# EAGLE schematic decoder (EAGLE 9.6.2)
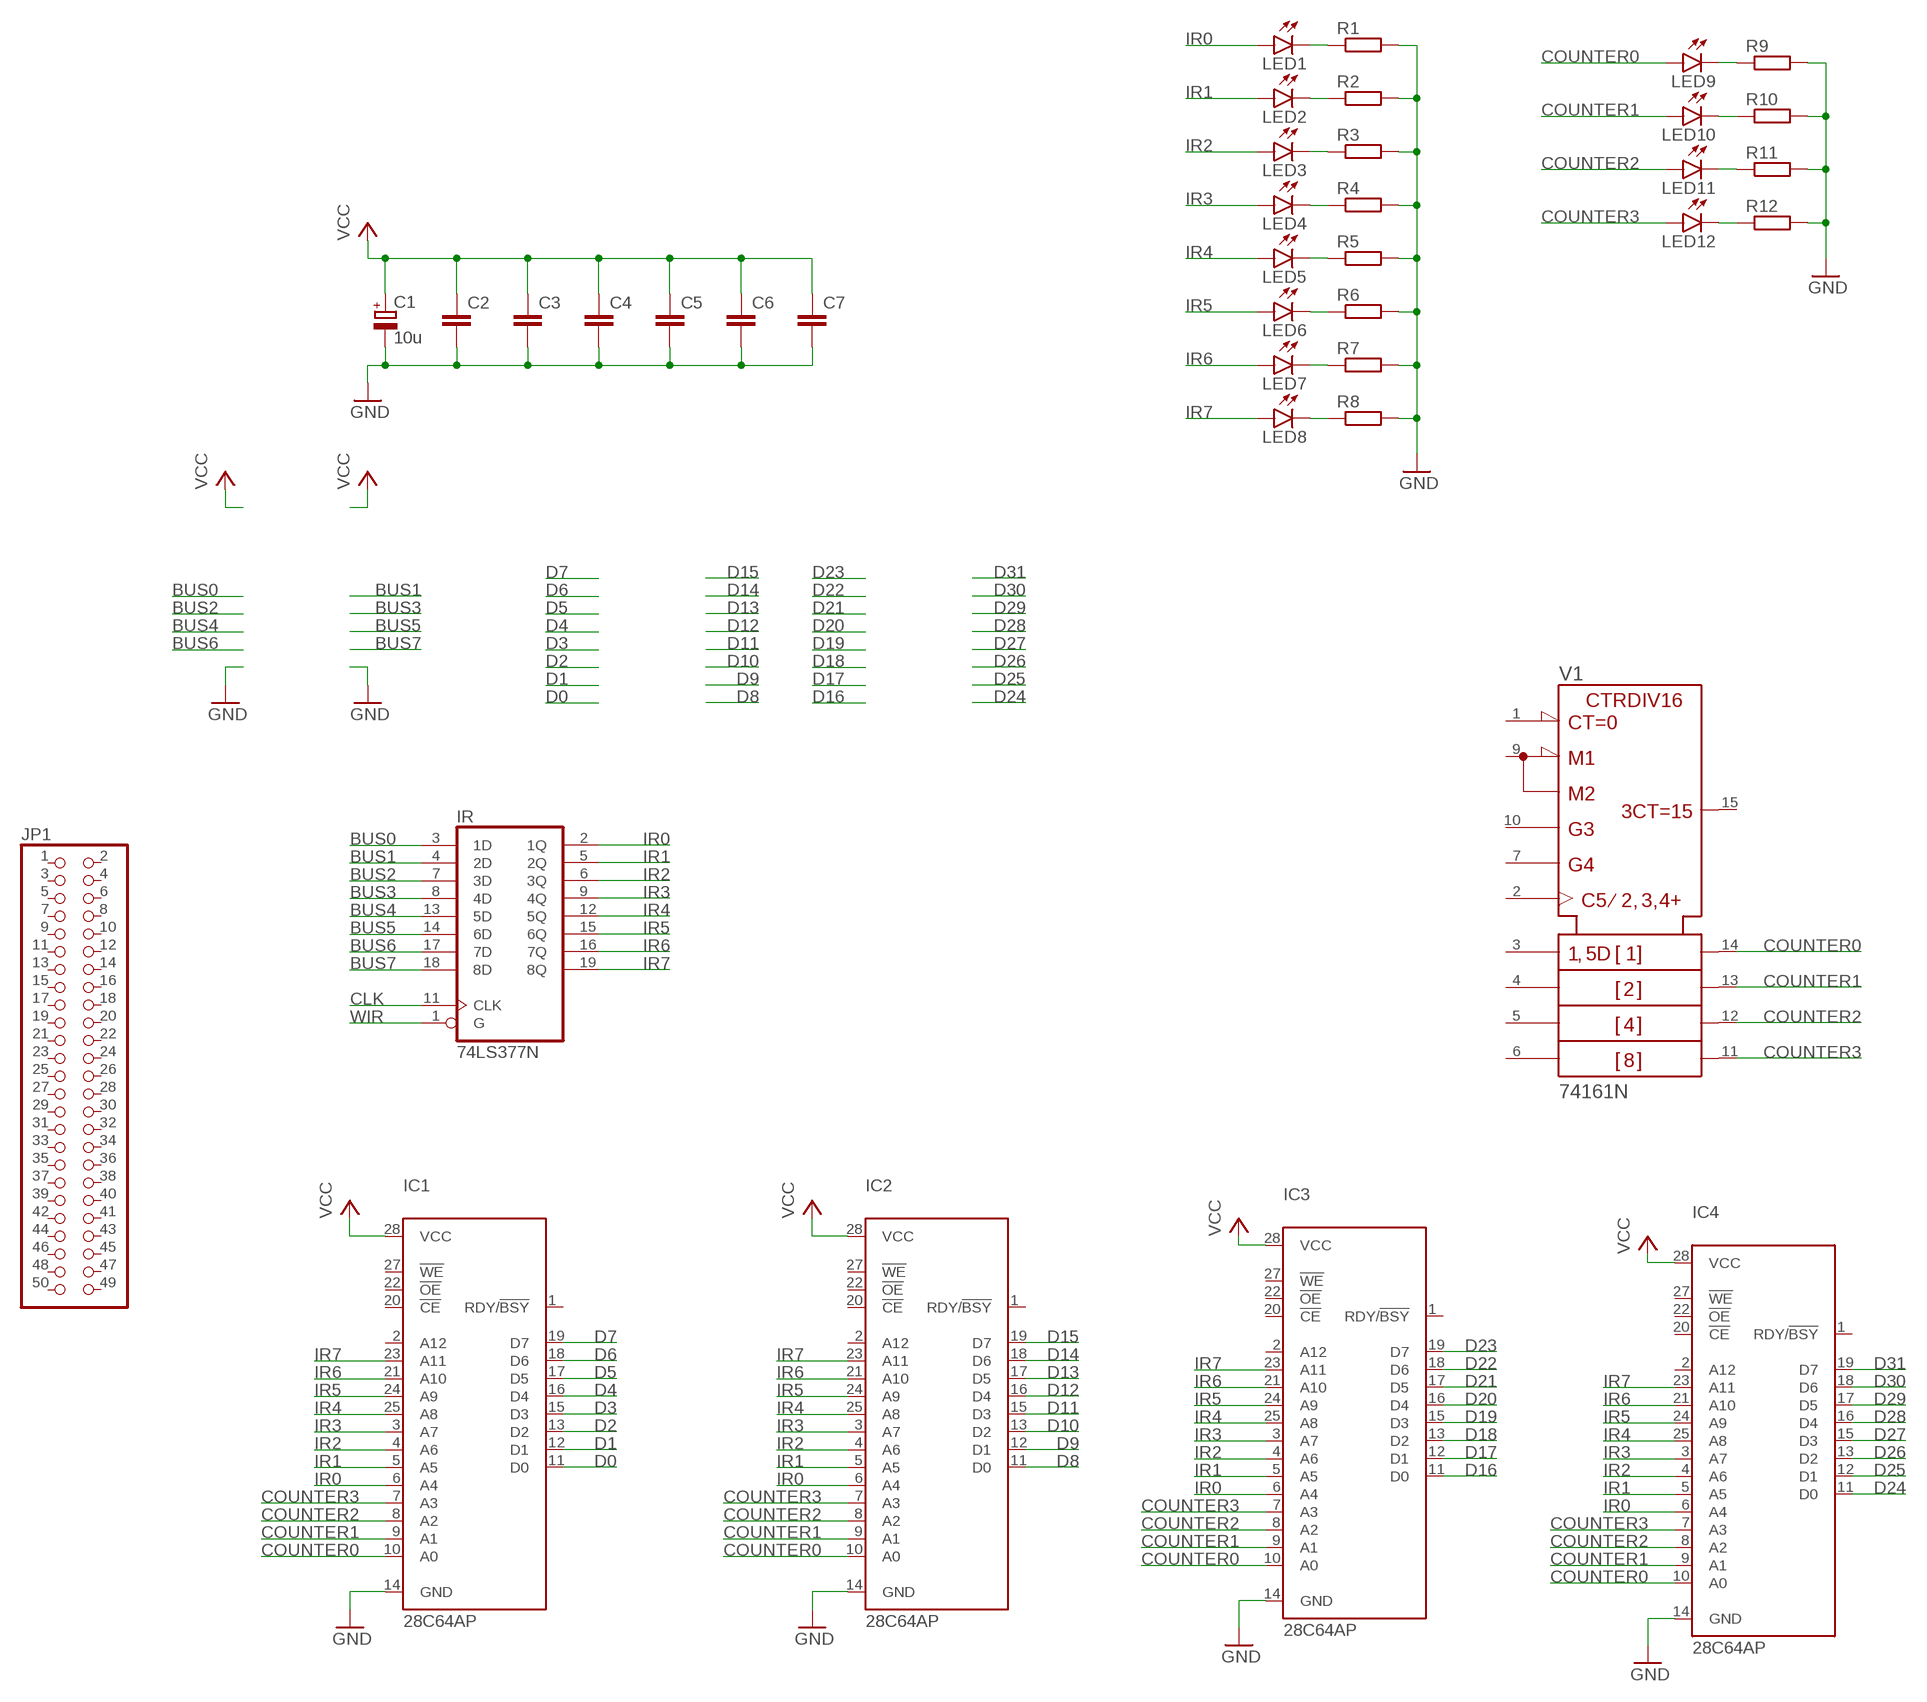
[diagram p0: schematic, sheet 1]

## Parts
C1  10u  CPOL-EUE5-8.5  [E5-8,5]
C2  C-EU025-024X044  [C025-024X044]
C3  C-EU025-024X044  [C025-024X044]
C4  C-EU025-024X044  [C025-024X044]
C5  C-EU025-024X044  [C025-024X044]
C6  C-EU025-024X044  [C025-024X044]
C7  C-EU025-024X044  [C025-024X044]
IC1  28C64AP  [DIL28-6]
IC2  28C64AP  [DIL28-6]
IC3  28C64AP  [DIL28-6]
IC4  28C64AP  [DIL28-6]
IR  74LS377N  [DIL20]
JP1  PINHD-2X25/90  [2X25/90]
LED1  LEDSML1206  [SML1206]
LED2  LEDSML1206  [SML1206]
LED3  LEDSML1206  [SML1206]
LED4  LEDSML1206  [SML1206]
LED5  LEDSML1206  [SML1206]
LED6  LEDSML1206  [SML1206]
LED7  LEDSML1206  [SML1206]
LED8  LEDSML1206  [SML1206]
LED9  LEDSML1206  [SML1206]
LED10  LEDSML1206  [SML1206]
LED11  LEDSML1206  [SML1206]
LED12  LEDSML1206  [SML1206]
R1  R-EU_R0805  [R0805]
R2  R-EU_R0805  [R0805]
R3  R-EU_R0805  [R0805]
R4  R-EU_R0805  [R0805]
R5  R-EU_R0805  [R0805]
R6  R-EU_R0805  [R0805]
R7  R-EU_R0805  [R0805]
R8  R-EU_R0805  [R0805]
R9  R-EU_R0805  [R0805]
R10  R-EU_R0805  [R0805]
R11  R-EU_R0805  [R0805]
R12  R-EU_R0805  [R0805]
V1  74161N  [DIL16]

## Nets
BUS0: IR.3(1D)
BUS1: IR.4(2D)
BUS2: IR.7(3D)
BUS3: IR.8(4D)
BUS4: IR.13(5D)
BUS5: IR.14(6D)
BUS6: IR.17(7D)
BUS7: IR.18(8D)
CLK: IR.11(CLK)
COUNTER0: IC1.10(A0) IC2.10(A0) IC3.10(A0) IC4.10(A0) LED9.A V1.14(QA)
COUNTER1: IC1.9(A1) IC2.9(A1) IC3.9(A1) IC4.9(A1) LED10.A V1.13(QB)
COUNTER2: IC1.8(A2) IC2.8(A2) IC3.8(A2) IC4.8(A2) LED11.A V1.12(QC)
COUNTER3: IC1.7(A3) IC2.7(A3) IC3.7(A3) IC4.7(A3) LED12.A V1.11(QD)
D0: IC1.11(D0)
D1: IC1.12(D1)
D2: IC1.13(D2)
D3: IC1.15(D3)
D4: IC1.16(D4)
D5: IC1.17(D5)
D6: IC1.18(D6)
D7: IC1.19(D7)
D8: IC2.11(D0)
D9: IC2.12(D1)
D10: IC2.13(D2)
D11: IC2.15(D3)
D12: IC2.16(D4)
D13: IC2.17(D5)
D14: IC2.18(D6)
D15: IC2.19(D7)
D16: IC3.11(D0)
D17: IC3.12(D1)
D18: IC3.13(D2)
D19: IC3.15(D3)
D20: IC3.16(D4)
D21: IC3.17(D5)
D22: IC3.18(D6)
D23: IC3.19(D7)
D24: IC4.11(D0)
D25: IC4.12(D1)
D26: IC4.13(D2)
D27: IC4.15(D3)
D28: IC4.16(D4)
D29: IC4.17(D5)
D30: IC4.18(D6)
D31: IC4.19(D7)
GND: C1.- C2.2 C3.2 C4.2 C5.2 C6.2 C7.2 IC1.14(GND) IC2.14(GND) IC3.14(GND) IC4.14(GND) R1.2 R2.2 R3.2 R4.2 R5.2 R6.2 R7.2 R8.2 R9.2 R10.2 R11.2 R12.2
IR0: IC1.6(A4) IC2.6(A4) IC3.6(A4) IC4.6(A4) IR.2(1Q) LED1.A
IR1: IC1.5(A5) IC2.5(A5) IC3.5(A5) IC4.5(A5) IR.5(2Q) LED2.A
IR2: IC1.4(A6) IC2.4(A6) IC3.4(A6) IC4.4(A6) IR.6(3Q) LED3.A
IR3: IC1.3(A7) IC2.3(A7) IC3.3(A7) IC4.3(A7) IR.9(4Q) LED4.A
IR4: IC1.25(A8) IC2.25(A8) IC3.25(A8) IC4.25(A8) IR.12(5Q) LED5.A
IR5: IC1.24(A9) IC2.24(A9) IC3.24(A9) IC4.24(A9) IR.15(6Q) LED6.A
IR6: IC1.21(A10) IC2.21(A10) IC3.21(A10) IC4.21(A10) IR.16(7Q) LED7.A
IR7: IC1.23(A11) IC2.23(A11) IC3.23(A11) IC4.23(A11) IR.19(8Q) LED8.A
N$1: LED1.C R1.1
N$2: LED2.C R2.1
N$3: LED3.C R3.1
N$4: LED4.C R4.1
N$5: LED5.C R5.1
N$6: LED6.C R6.1
N$7: LED7.C R7.1
N$8: LED8.C R8.1
N$9: LED9.C R9.1
N$10: LED10.C R10.1
N$11: LED11.C R11.1
N$12: LED12.C R12.1
VCC: C1.+ C2.1 C3.1 C4.1 C5.1 C6.1 C7.1 IC1.28(VCC) IC2.28(VCC) IC3.28(VCC) IC4.28(VCC)
WIR: IR.1(G)
Unconnected: IC1.1(RDY/!BSY) IC1.2(A12) IC1.20(!CE) IC1.22(!OE) IC1.27(!WE) IC2.1(RDY/!BSY) IC2.2(A12) IC2.20(!CE) IC2.22(!OE) IC2.27(!WE) IC3.1(RDY/!BSY) IC3.2(A12) IC3.20(!CE) IC3.22(!OE) IC3.27(!WE) IC4.1(RDY/!BSY) IC4.2(A12) IC4.20(!CE) IC4.22(!OE) IC4.27(!WE) JP1.1 JP1.2 JP1.3 JP1.4 JP1.5 JP1.6 JP1.7 JP1.8 JP1.9 JP1.10 JP1.11 JP1.12 JP1.13 JP1.14 JP1.15 JP1.16 JP1.17 JP1.18 JP1.19 JP1.20 JP1.21 JP1.22 JP1.23 JP1.24 JP1.25 JP1.26 JP1.27 JP1.28 JP1.29 JP1.30 JP1.31 JP1.32 JP1.33 JP1.34 JP1.35 JP1.36 JP1.37 JP1.38 JP1.39 JP1.40 JP1.41 JP1.42 JP1.43 JP1.44 JP1.45 JP1.46 JP1.47 JP1.48 JP1.49 JP1.50 V1.1(!CLR) V1.2(CLK) V1.3(A) V1.4(B) V1.5(C) V1.6(D) V1.7(ENP) V1.9(!LOAD) V1.10(ENT) V1.15(RCO)

## Power pins joined to a net without a drawn wire
+UB: V1.16(+UB)
-UB: V1.8(-UB)
GND: IR.10(GND)
VCC: IR.20(VCC)

## Library data of the parts
C1 = rcl:CPOL-EU: POLARIZED CAPACITOR, European symbol; SPICEPREFIX: C
C2-C7 = rcl:C-EU: CAPACITOR, European symbol; SPICEPREFIX: C
IC1-IC4 = microchip:28*64A: CMOS EEPROM 64 K (8 K x 8), low voltage; MPN: AT28C64B-15PU; OC_FARNELL: 1631144; OC_NEWARK: 96K6557
IR = 74xx-eu:74*377: Octal D type FLIP FLOP, enable
JP1 = pinhead:PINHD-2X25: PIN HEADER
LED1-LED12 = led:LED: LED OSRAM: - CHIPLED LG R971, LG N971, LY N971, LG Q971, LY Q971, LO R971, LY R971 LH N974, LH R974 LS Q976, LO Q976, LY Q976 LO Q996 - Hyper CHIPLED LW Q18S LB Q993, LB Q99A, LB R99A - SideLED LS A670, LO A670, LY A670, LG A670, LP A670 LB A673, LV A673, LT A673, LW A673 LH A674 LY A675 LS A676, LA A676, LO A676, LY A676, LW A676 LS A679, LY A679, LG A679 - Hyper Micro SIDELED® LS Y876, LA Y876, LO Y876, LY Y876 LT Y87S - SmartLED LW L88C, LW L88S LB L89C, LB L89S, LG L890 LS L89K, LO L89K, LY L89K LS L896, LA L896, LO L896, LY L896 - TOPLED LS T670, LO T670, LY T670, LG T670, LP T670 LSG T670, LSP T670, LSY T670, LOP T670, LYG T670 LG T671, LOG T671, LSG T671 LB T673, LV T673, LT T673, LW T673 LH T674 LS T676, LA T676, LO T676, LY T676, LB T676, LH T676, LSB T676, LW T676 LB T67C, LV T67C, LT T67C, LS T67K, LO T67K, LY T67K, LW E67C LS E67B, LA E67B, LO E67B, LY E67B, LB E67C, LV E67C, LT E67C LW T67C LS T679, LY T679, LG T679 LS T770, LO T770, LY T770, LG T770, LP T770 LB T773, LV T773, LT T773, LW T773 LH T774 LS E675, LA E675, LY E675, LS T675 LS T776, LA T776, LO T776, LY T776, LB T776 LHGB T686 LT T68C, LB T68C - Hyper Mini TOPLED® LB M676 - Mini TOPLED Santana® LG M470 LS M47K, LO M47K, LY M47K Source: http://www.osram.convergy.de LUXEON: - LUMILED® LXK2-PW12-R00, LXK2-PW12-S00, LXK2-PW14-U00, LXK2-PW14-V00 LXK2-PM12-R00, LXK2-PM12-S00, LXK2-PM14-U00 LXK2-PE12-Q00, LXK2-PE12-R00, LXK2-PE12-S00, LXK2-PE14-T00, LXK2-PE14-U00 LXK2-PB12-K00, LXK2-PB12-L00, LXK2-PB12-M00, LXK2-PB14-N00, LXK2-PB14-P00, LXK2-PB14-Q00 LXK2-PR12-L00, LXK2-PR12-M00, LXK2-PR14-Q00, LXK2-PR14-R00 LXK2-PD12-Q00, LXK2-PD12-R00, LXK2-PD12-S00 LXK2-PH12-R00, LXK2-PH12-S00 LXK2-PL12-P00, LXK2-PL12-Q00, LXK2-PL12-R00 Source: www.luxeon.com KINGBRIGHT: KA-3528ASYC Source: www.kingbright.com
R1-R12 = rcl:R-EU_: RESISTOR, European symbol; SPICEPREFIX: R
V1 = 74ttl-din:74*161: Synchrounus 4-bit COUNTER

## Net classes
0 default: clearance 0.205 mm